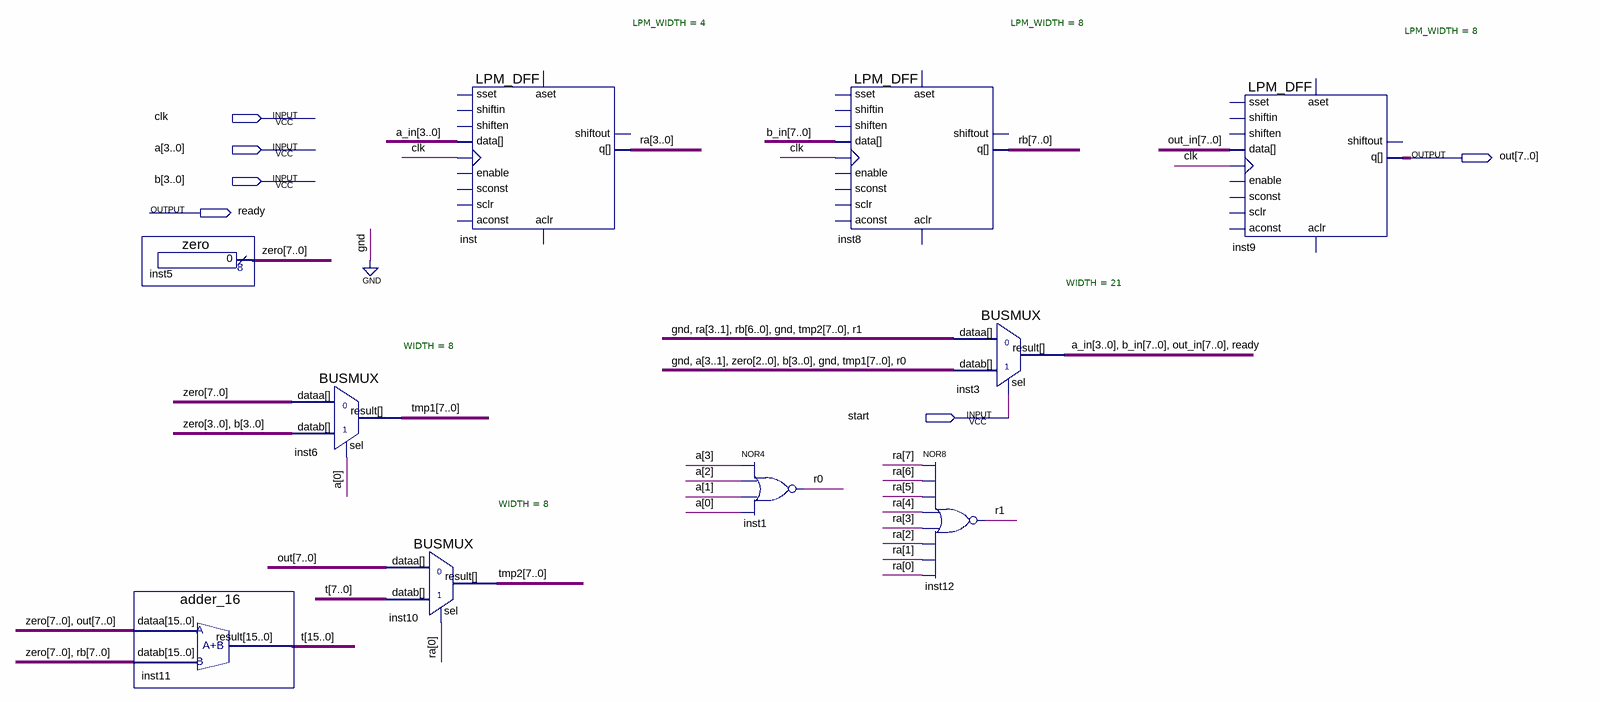
[diagram p0: schematic sheet]
// Quartus schematic unsigned_multiplier_4.bdf as structural Verilog: 10 symbols, 6 pins
module unsigned_multiplier_4 (
  input  clk,
  input  [3:0] a,
  input  [3:0] b,
  input  start,
  output [7:0] out,
  output ready
);

  wire r0, r1;
  wire [3:0] a_in;
  wire [7:0] b_in, out_in, ra, rb, tmp1, tmp2, zero;
  wire [15:0] t;

  adder_16 inst11 (.dataa({zero, out}), .datab({zero, rb}), .result(t));
  zero inst5 (.result(zero));
  BUSMUX #(.WIDTH(8)) inst6 (.datab({zero[3:0], b}), .sel(a[0]), .dataa(zero), .result(tmp1));
  BUSMUX #(.WIDTH(8)) inst10 (.datab(t[7:0]), .sel(ra[0]), .dataa(out), .result(tmp2));
  LPM_DFF #(.LPM_WIDTH(4)) inst (
    .clock(clk), .data(a_in), .q(ra[3:0]));  // open: shiftin, shiften, enable, aconst, sclr, sconst, sset, aset, aclr, shiftout
  nor inst1 (r0, a[3], a[2], a[1], a[0]);
  LPM_DFF #(.LPM_WIDTH(8)) inst8 (
    .clock(clk), .data(b_in), .q(rb));  // open: shiftin, shiften, enable, aconst, sclr, sconst, sset, aset, aclr, shiftout
  BUSMUX #(.WIDTH(21)) inst3 (
    .datab({1'b0, a[3:1], zero[2:0], b, 1'b0, tmp1, r0}), .sel(start),
    .dataa({1'b0, ra[3:1], rb[6:0], 1'b0, tmp2, r1}), .result({a_in, b_in, out_in, ready}));
  nor inst12 (r1, ra[7], ra[6], ra[5], ra[4], ra[3], ra[2], ra[1], ra[0]);
  LPM_DFF #(.LPM_WIDTH(8)) inst9 (
    .clock(clk), .data(out_in), .q(out));  // open: shiftin, shiften, enable, aconst, sclr, sconst, sset, aset, aclr, shiftout
endmodule
